# Altium schematic sheet LHC_audio.SchDoc
size A
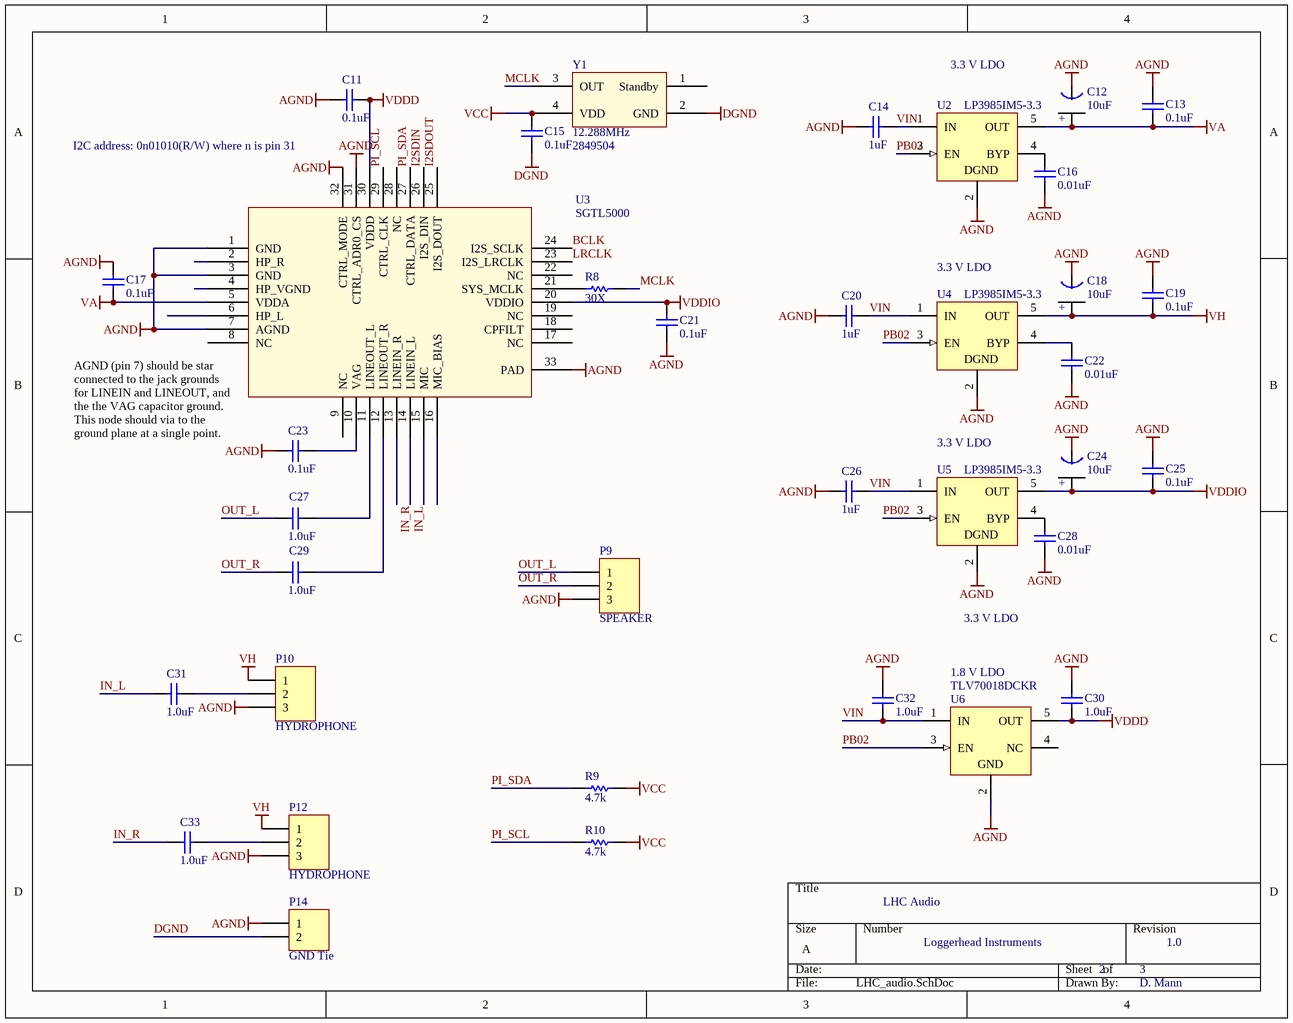
[diagram p0: LHC_audio.SchDoc]

## Parts
C11  0.1uF  [0402]
C12  10uF  [Tant0805]
C13  0.1uF  [0402]
C14  1uF  [0402]
C15  0.1uF  [0402]
C16  0.01uF  [0402]
C17  0.1uF  [0402]
C18  10uF  [Tant0805]
C19  0.1uF  [0402]
C20  1uF  [0402]
C21  0.1uF  [0402]
C22  0.01uF  [0402]
C23  0.1uF  [0402]
C24  10uF  [Tant0805]
C25  0.1uF  [0402]
C26  1uF  [0402]
C27  1.0uF  [0402]
C28  0.01uF  [0402]
C29  1.0uF  [0402]
C30  1.0uF  [0402]
C31  1.0uF  [0402]
C32  1.0uF  [0402]
C33  1.0uF  [0402]
P9  SPEAKER  [HDR1X3]
P10  HYDROPHONE  [HDR1X3]
P12  HYDROPHONE  [HDR1X3]
P14  GND Tie  [HDR1X2]
R8  30X  [3-0603]
R9  4.7k  [3-0603]
R10  4.7k  [3-0603]
U2  LP3985IM5-3.3  [MF05A_N]
U3  SGTL5000  [QFN32]
U4  LP3985IM5-3.3  [MF05A_N]
U5  LP3985IM5-3.3  [MF05A_N]
U6  TLV70018DCKR  [TI-DCK5_V]
Y1  12.288MHz  Supplier Part Number 1: 2849504  [Oscillator_5x3.2]

## Nets
AGND: C11.2 C12.1(GND) C13.2 C14.2 C16.2 C17.2 C18.1(GND) C19.2 C20.2 C21.2 C22.2 C23.2 C24.1(GND) C25.2 C26.2 C28.2 C30.2 C32.2 P9.3 P10.3 P12.3 P14.1 U2.2(GND) U3.1(GND) U3.3(GND) U3.7(AGND) U3.31(CTRL_ADR0_CS) U3.32(CTRL_MODE) U3.33(PAD) U4.2(GND) U5.2(GND) U6.2(GND)
DGND: C15.2 P14.2 Y1.2(GND)
VA: C12.2(+) C13.1 C17.1 U2.5(OUT) U3.5(VDDA)
VCC: C15.1 R9.2 R10.2 Y1.4(VDD)
VDDD: C11.1 C30.1 U3.30(VDDD) U6.5(OUT)
VDDIO: C21.1 C24.2(+) C25.1 U3.20(VDDIO) U5.5(OUT)
VH: C18.2(+) C19.1 P10.1 P12.1 U4.5(OUT)
BCLK: U3.24(I2S_SCLK)
I2SDIN: U3.26(I2S_DIN)
I2SDOUT: U3.25(I2S_DOUT)
IN_L: C31.2 U3.14(LINEIN_L)
IN_R: C33.2 U3.13(LINEIN_R)
LRCLK: U3.23(I2S_LRCLK)
MCLK: R8.2 Y1.3(OUT)
OUT_L: C27.1 P9.1
OUT_R: C29.1 P9.2
PB02: U2.3(EN) U4.3(EN) U5.3(EN) U6.3(EN)
PI_SCL: R10.1 U3.29(CTRL_CLK)
PI_SDA: R9.1 U3.27(CTRL_DATA)
VIN: C14.1 C20.1 C26.1 C32.1 U2.1(IN) U4.1(IN) U5.1(IN) U6.1(IN)
NetC16_1: C16.1 U2.4(BYP)
NetC22_1: C22.1 U4.4(BYP)
NetC23_1: C23.1 U3.10(VAG)
NetC27_2: C27.2 U3.11(LINEOUT_L)
NetC28_1: C28.1 U5.4(BYP)
NetC29_2: C29.2 U3.12(LINEOUT_R)
NetC31_1: C31.1 P10.2
NetC33_1: C33.1 P12.2
NetR8_1: R8.1 U3.21(SYS_MCLK)

Not connected (* = marked no-connect by the designer): U3 2(HP_R) 4(HP_VGND) 6(HP_L) 8(NC) 9(NC) 15(MIC) 16(MIC_BIAS) 17(NC) 18(CPFILT) 19(NC) 22(NC) 28(NC); U6 4(NC); Y1 1(Standby)

## Notes on the sheet
- 3.3 V LDO
- I2C address: 0n01010(R/W) where n is pin 31
- (near U4) 3.3 V LDO
- (near U3) AGND (pin 7) should be star connected to the jack grounds for LINEIN and LINEOUT, and the the VAG capacitor ground. This node should via to the ground plane at a single point.
- (near U5) 3.3 V LDO
- (near U6) 1.8 V LDO
- LHC Audio
- Loggerhead Instruments
- 2
- 3
- 1.0
- D. Mann
- (in symbol LP3985IM5-3.3) DGND

## Library data of the parts
C11 C13 C15 C17 C19 C21 C23 C25 = C0402: Ceramic Chip Capacitor - Standard; Note: Footprint corresponds to dimensions for bulk cassette packaging. This case size has tightened tolerances.; Published: 17-Jul-2002; LatestRevisionDate: 19-Mar-2004; LatestRevisionNote: Silkscreen size reduced.; DatasheetDocument: Mar-2001; PackageDocument: Mar-2001; PackageReference: 0402; Publisher: Altium Limited; Code_JEITA: 0402; Code_IPC: 1005 [0402]; ComponentLink1Description: Manufacturer Link; ComponentLink1URL: http://www.kemet.com/; ComponentLink2Description: Datasheet; ComponentLink2URL: http://www.kemet.com/kemet/web/homepage/kechome.nsf/vapubfilesname/F3102TA.pdf/$file/F3102TA.pdf; Value: 0.1uF
C12 C18 C24 = Tant0805: Value: 10uF
C14 C16 C20 C22 C26-C33 = C0402: Ceramic Chip Capacitor - Standard; Note: Footprint corresponds to dimensions for bulk cassette packaging. This case size has tightened tolerances.; Value: 0.1uF; Published: 17-Jul-2002; LatestRevisionDate: 19-Mar-2004; LatestRevisionNote: Silkscreen size reduced.; DatasheetDocument: Mar-2001; PackageDocument: Mar-2001; PackageReference: 0402; Publisher: Altium Limited; Code_JEITA: 0402; Code_IPC: 1005 [0402]; ComponentLink1Description: Manufacturer Link; ComponentLink1URL: http://www.kemet.com/; ComponentLink2Description: Datasheet; ComponentLink2URL: http://www.kemet.com/kemet/web/homepage/kechome.nsf/vapubfilesname/F3102TA.pdf/$file/F3102TA.pdf
P9 P10 P12 = Header 3: Header, 3-Pin; LatestRevisionDate: 17-Jul-2002; LatestRevisionNote: Re-released for DXP Platform.; Publisher: Altium Limited
P14 = Header 2: Header, 2-Pin; LatestRevisionDate: 17-Jul-2002; LatestRevisionNote: Re-released for DXP Platform.; Publisher: Altium Limited
R8-R10 = ERJ3RK: Precision Thick Film Chip Resistor, 10 Ohm to 1M Ohm Range, 1% and 0.5% Tolerance, 0603 Size, 0.063 W; Published: 17-Dec-2003; LatestRevisionDate: 19-Mar-2004; LatestRevisionNote: Silkscreen size reduced.; PackageDocument: Mar-2003; PackageReference: 3-0603; Publisher: Altium Limited; Code_IPC: 1608 [0603]; ComponentLink1Description: Manufacturer Link; ComponentLink1URL: http://www.panasonic.com/industrial/components/resistive_products.htm; ComponentLink2Description: Datasheet; ComponentLink2URL: http://www.panasonic.com/industrial/components/pdf/AOA0000CE2.pdf
U2 U4 U5 = LP3985IM5-3.3: Micropower, 150mA Low-Noise Ultra Low-Dropout CMOS Voltage Regulator; Manufacturer: National Semiconductor; CompType: LDO IC; PackageTopMarking: LDQB*XTT; PowerWise: N; Published: 4-Dec-2008; DatasheetVersion: Aug-2005; PackageVersion: revD, Aug-2008; PackageReference: MF05A; Publisher: Altium Limited; PackageDescription: Molded SOT-23, .115 x .063 x .040 in Body, 5 Lead, .0375 in Pitch; PartNumber: LP3985IM5-3.3; RoHS: O; PinCount: 5; DigiKeyPartNumber: LP3985IM5-3.3CT-ND; ComponentLink1Description: LP3985 Datasheet; ComponentLink1URL: http://www.national.com/ds/LP/LP3985.pdf; ComponentLink2Description: LP3985 Web Page; ComponentLink2URL: http://www.national.com/pf/LP/LP3985.html; ComponentLink3Description: MF05A Package Page; ComponentLink3URL: http://www.national.com/packaging/folders/mf05a.html
U6 = TLV70018DCKR: Single Output LDO, 200 mA, Fixed 1.8 V Output, 2 to 5.5 V Input, with Low IQ, 5-pin SC70 (DCK), -40 to 125 degC, Green (RoHS & no Sb/Br); Manufacturer: Texas Instruments; Accuracy(%): 2; Fixed Output Options(V): 1.8; Iout(Max)(A): 0.2; Iq(Typ)(mA): 0.03; SubFamily: Single Channel LDO; Vdo(Typ)(mV): 175; Vin(Max)(V): 5.5; DatasheetVersion: SLVSA00D; PackageVersion: 4093553-3/G; PackageReference: DCK5; PackageDescription: 5-Pin Plastic Small-Outline, Body 2 x 1.25 mm, Pitch 0.65 mm; Supplier 1: Digi-Key; Supplier Part Number 1: 296-32409-2-ND; Supplier 2: Digi-Key; Supplier Part Number 2: 296-32409-1-ND; Supplier 3: Digi-Key; Supplier Part Number 3: 296-32409-6-ND; Supplier 4: Newark; Supplier Part Number 4: 55R7461; Supplier 5: Mouser; Supplier Part Number 5: 595-TLV70018DCKR; Eco-Plan: Green (RoHS & no Sb/Br); Vin(Min)(V): 2; Vout Adj(Max)(V): 1.8; Vout Adj(Min)(V): 1.8; Mounting Technology: Surface Mount; Code_JEDEC: MO-203; PartNumber: TLV70018DCKR; ComponentLink1Description: Manufacturer URL; ComponentLink1URL: http://www.ti.com/; ComponentLink2Description: Datasheet; ComponentLink2URL: http://www.ti.com/general/docs/lit/getliterature.tsp?genericPartNumber=TLV70018&fileType=pdf; ComponentLink3Description: Package Specification; ComponentLink3URL: http://www.ti.com/litv/pdf/mpds025f
Y1 = Oscillator_5x3.2: Supplier 1: Farnell; Oscillator: 12.288MHz